# EasyEDA schematic SCH_QC_Trigger_2022-11-12.json
TITLE: QC Trigger; REV: 1.0; Date: 2022-11-07; Sheet: 1/1; Drawn By: azlanikram; Company: Azlan Ikram
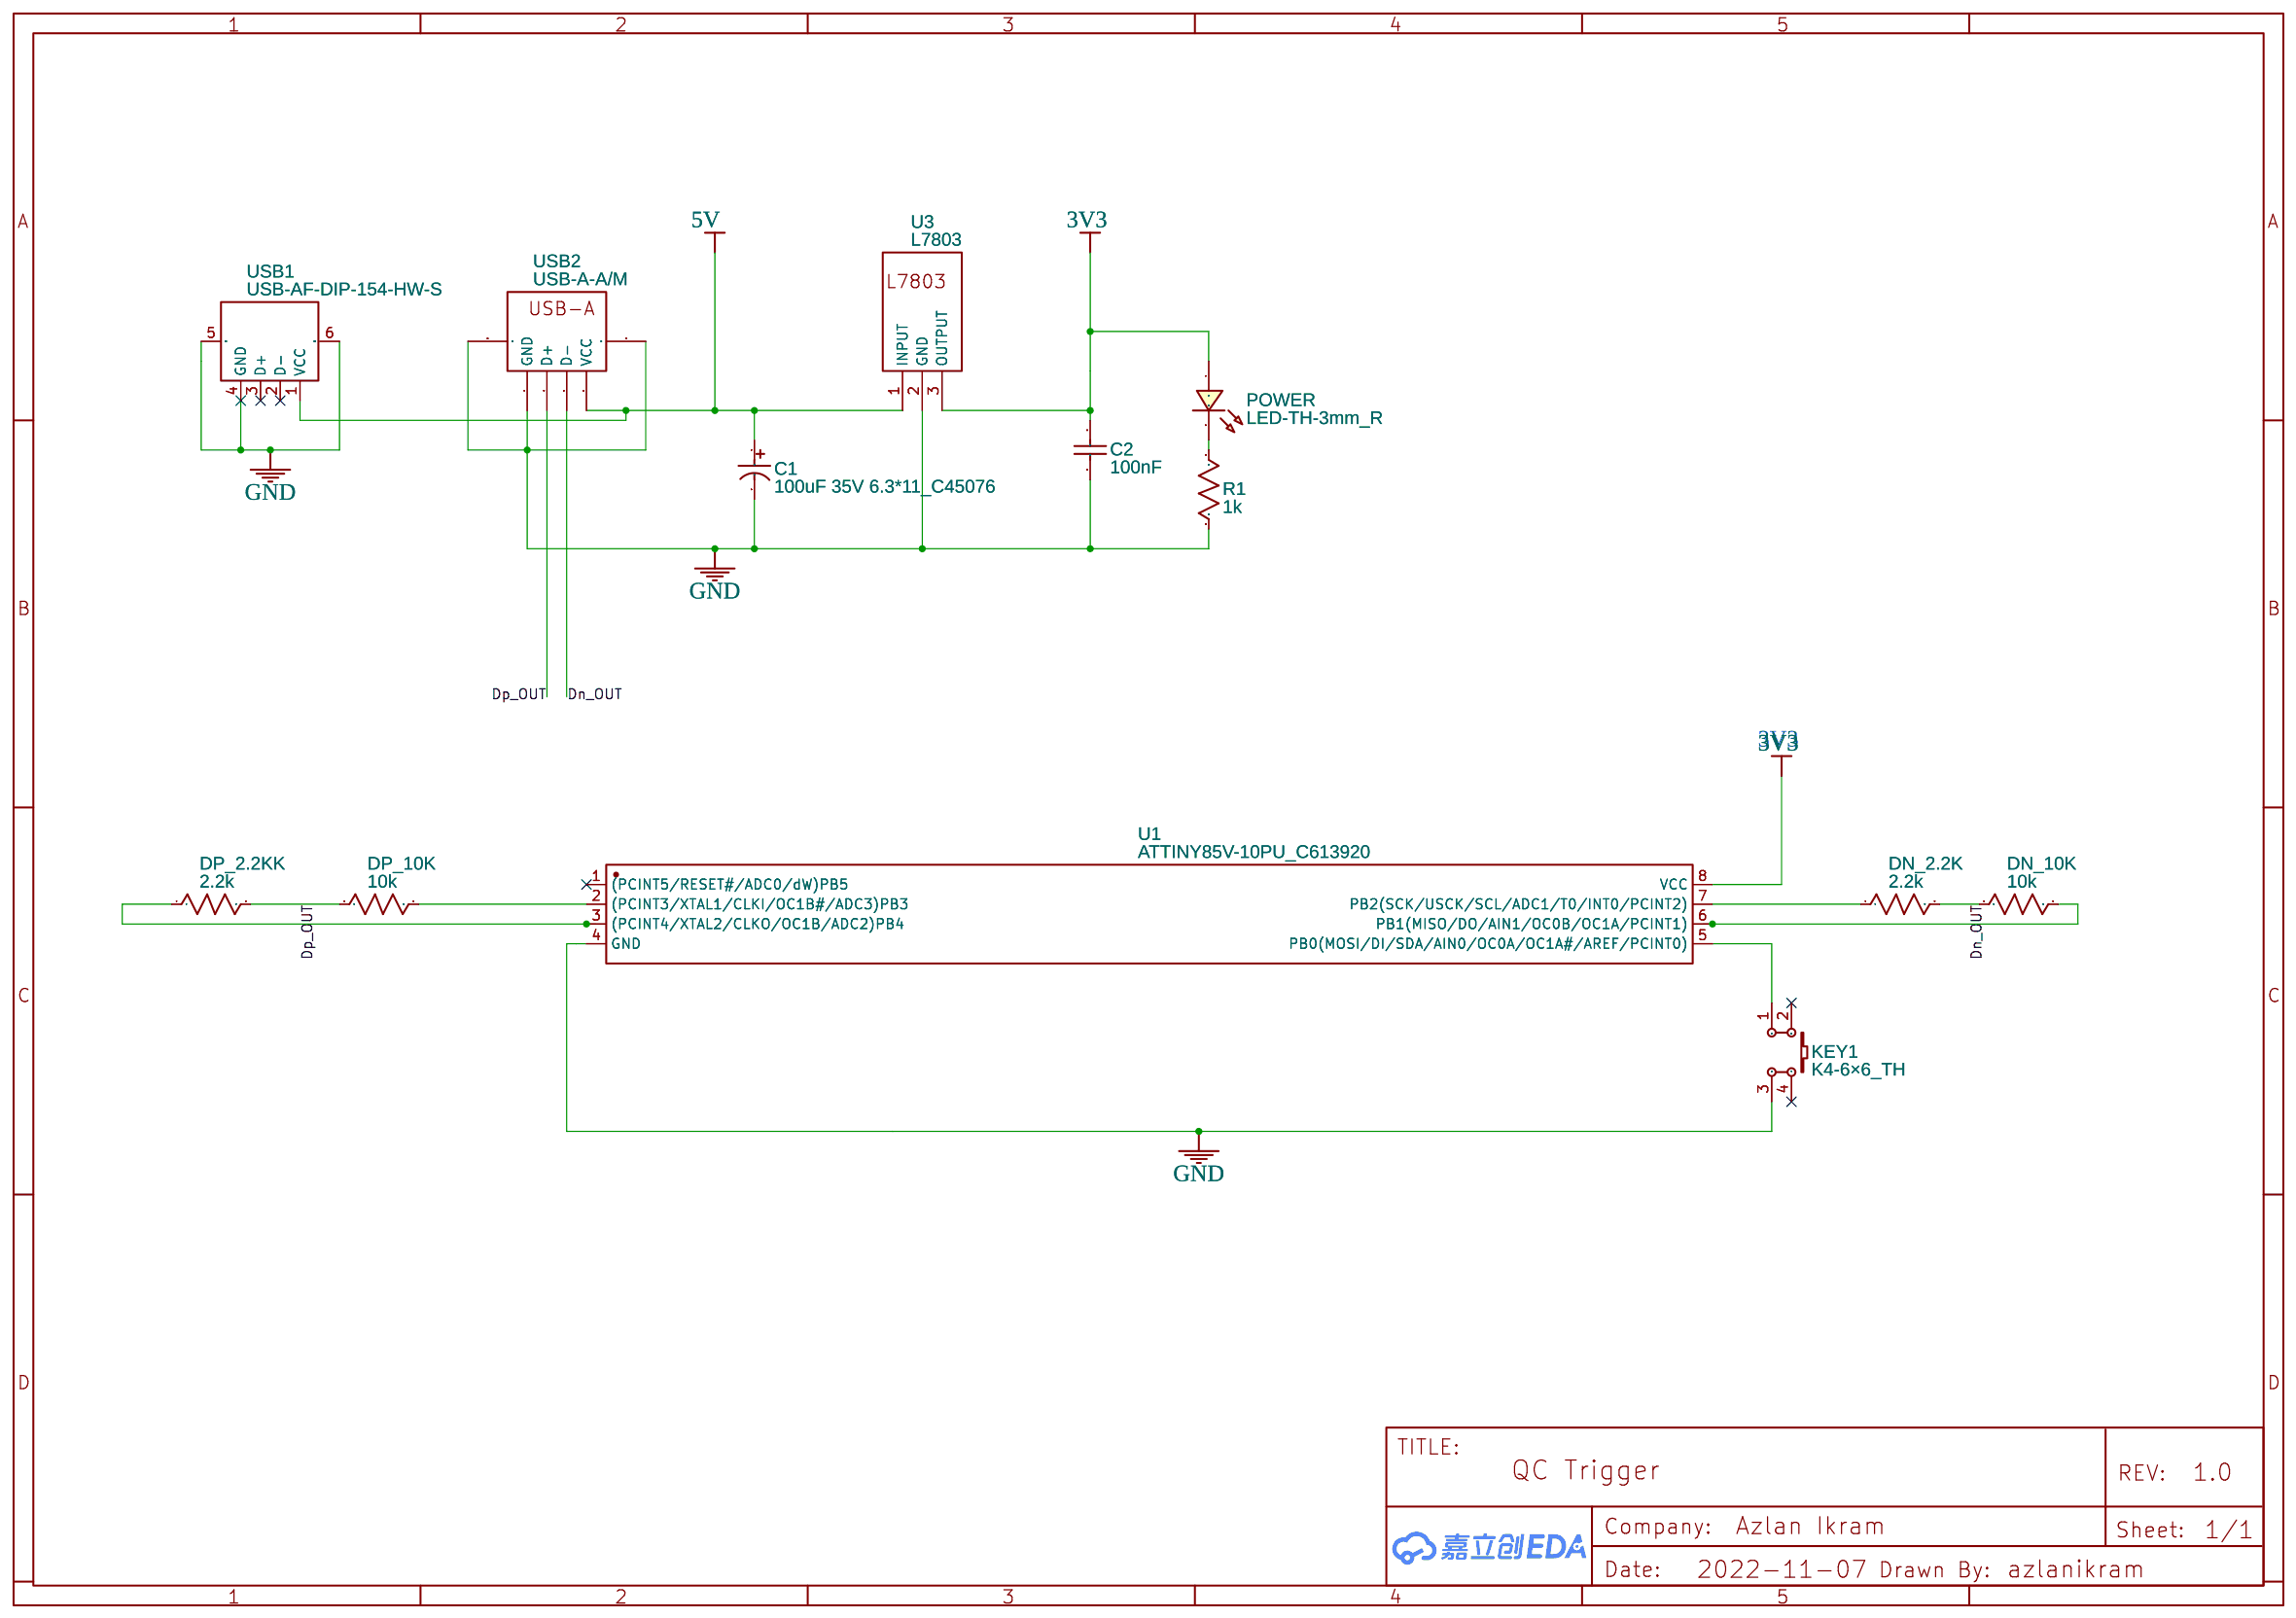
[diagram p0: schematic sheet]

## Parts
C1  100uF 35V 6.3*11_C45076  [CAP-TH_BD6.3-P2.50-D0.5-FD]
C2  100nF  [CAP-TH_L6.5-W4.0-P5.00-D1.0]
DN_2.2K  2.2k  [R_AXIAL-0.5]
DN_10K  10k  [R_AXIAL-0.5]
DP_2.2KK  2.2k  [R_AXIAL-0.5]
DP_10K  10k  [R_AXIAL-0.5]
KEY1  K4-6×6_TH  [KEY-TH_4P-L6.0-W6.0-P4.50-LS6.5]
POWER  LED-TH-3mm_R  [LED-TH_BD3.0_RED]
R1  1k  [R_AXIAL-0.5]
U1  ATTINY85V-10PU_C613920  [PDIP-8_L9.6-W6.4-P2.54-LS7.6-BL]
U3  L7803  [L7803]
USB1  USB-AF-DIP-154-HW-S  [USB-A-TH_USB-AF-DIP-154-HW-S]
USB2  USB-A-A/M  [USB-A-SMD_USB-A-1-TH]

## Library data of the parts
C1 = 100uF 35V 6.3*11_C45076: Supplier Part: C45076; Supplier: LCSC; Manufacturer: ValuePro; Manufacturer Part: 100uF 35V 6.3*11; JLCPCB Part Class: Extended Part
C2 = 104J 100V: Supplier: LCSC; Manufacturer: ReliaPro; Contributor: LCSC; Supplier Part: C13547
DN_2.2K DN_10K DP_2.2KK DP_10K R1 = R_AXIAL-0.5_US: Contributor: LCEDA_Lib
KEY1 = K4-6×6_TH: Supplier: LCSC; Supplier Part: C136684; Manufacturer: 韩国韩荣; Manufacturer Part: K2-1102DP-E4SW-04; Contributor: LCEDA_Lib
POWER = LED-TH-3mm_R: Manufacturer: EVERLIGHT(台湾亿光); Manufacturer Part: 204-10SDRD/S530-A3-L; Supplier Part: C84774; Supplier: LCSC; Contributor: LCEDA_Lib
U1 = ATTINY85V-10PU_C613920: Supplier: LCSC; Supplier Part: C613920; Manufacturer: null; Manufacturer Part: ATTINY85V-10PU; Contributor: LCSC
U3 = L7803: Contributor: nayeem2121
USB1 = USB-AF-DIP-154-HW-S: Supplier: LCSC; Supplier Part: C2904892; Manufacturer: 皇捷; Contributor: LCSC; JLCPCB Part Class: Extended Part
USB2 = USB-A-A/M Stick plate bent legs VinylPBT With a column: Supplier: LCSC; Manufacturer: ValuePro; Manufacturer Part: A/M Stick plate bent legs VinylPBT With a column; Supplier Part: C46394

## Nets
3V3: C2.2 POWER.1 U1.8(VCC) U3.3(OUTPUT)
5V: C1.1 U3.1(INPUT) USB1.1(VCC) USB2.1(VCC)
GND: C1.2 C2.1 KEY1.3 R1.2 U1.4(GND) U3.2(GND) USB1.4(GND) USB1.5(SH1) USB1.6(SH2) USB2.4(GND) USB2.5 USB2.6
Dn_OUT: DN_2.2K.2 DN_10K.1 USB2.2(D-)
Dp_OUT: DP_2.2KK.2 DP_10K.1 USB2.3(D+)
Net-(DN_2.2K-1): DN_2.2K.1 U1.7(PB2(SCK/USCK/SCL/ADC1/T0/INT0/PCINT2))
Net-(DN_10K-2): DN_10K.2 U1.6(PB1(MISO/DO/AIN1/OC0B/OC1A/PCINT1))
Net-(DP_2.2KK-1): DP_2.2KK.1 U1.3((PCINT4/XTAL2/CLKO/OC1B/ADC2)PB4)
Net-(DP_10K-2): DP_10K.2 U1.2((PCINT3/XTAL1/CLKI/OC1B#/ADC3)PB3)
Net-(KEY1-1): KEY1.1 U1.5(PB0(MOSI/DI/SDA/AIN0/OC0A/OC1A#/AREF/PCINT0))
Net-(POWER-2): POWER.2 R1.1

Not connected (* = marked no-connect by the designer): KEY1 2* 4*; U1 1((PCINT5/RESET#/ADC0/dW)PB5)*; USB1 2(D-)* 3(D+)*

## Notes on the sheet
- 3V3
